# Altium schematic sheet Power_Tree.SchDoc
size A; SheetNumber: 3; SheetTotal: 5
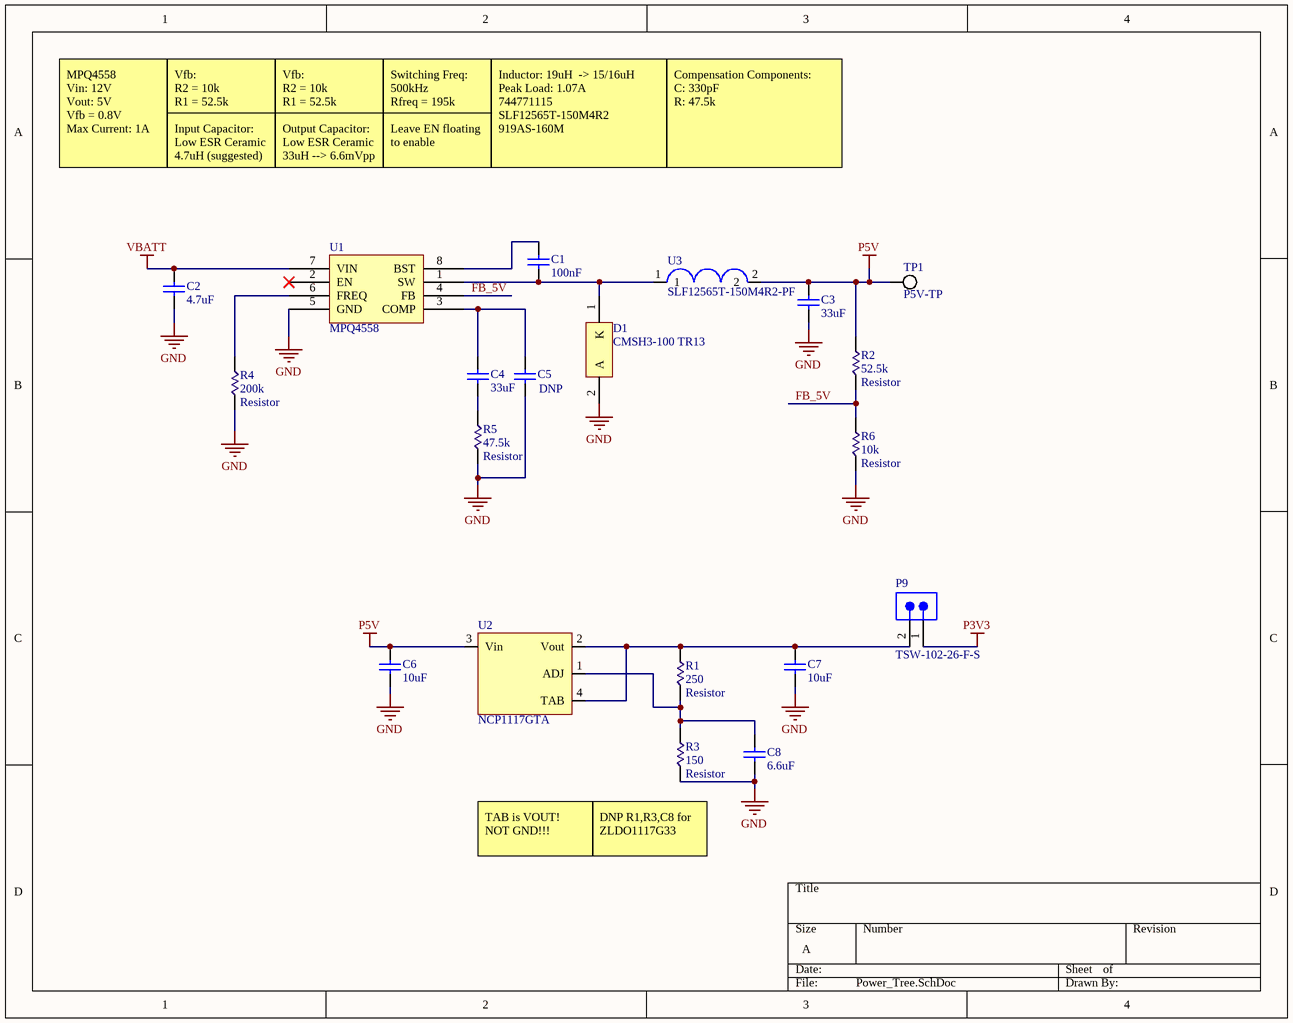
[diagram p0: Power_Tree.SchDoc]

## Parts
C1  value 100nF  [FOOTPRINT-1206-GEN]  (hidden comment: 100nF 1206)
C2  value 4.7uF  [FOOTPRINT-1206-GEN]  (hidden comment: CL31B475KBHVPNE)
C3  value 33uF  [FOOTPRINT-1206-GEN]
C4  value 33uF  [FOOTPRINT-1206-GEN]
C5  DNP  [FOOTPRINT-1206-GEN]
C6  value 10uF  [FOOTPRINT-1206-GEN]
C7  value 10uF  [FOOTPRINT-1206-GEN]
C8  value 6.6uF  [FOOTPRINT-1206-GEN]
D1  CMSH3-100 TR13  [ONSC-SMB-2-403A-03_V]
P9  TSW-102-26-F-S  [SMTC-TSW-102-26-XX-S]
R1  value 250  Type: Resistor  [FOOTPRINT-1206-GEN]  (hidden comment: Resistor 250 +/-1% 1206 1/4W)
R2  value 52.5k  Type: Resistor  [FOOTPRINT-1206-GEN]  (hidden comment: Resistor 52.5k +/-1% 1206 1/4W)
R3  value 150  Type: Resistor  [FOOTPRINT-1206-GEN]  (hidden comment: Resistor 150 +/-1% 1206 1/4W)
R4  value 200k  Type: Resistor  [FOOTPRINT-1206-GEN]  (hidden comment: Resistor 200k +/-1% 1206 1/4W)
R5  value 47.5k  Type: Resistor  [FOOTPRINT-1206-GEN]  (hidden comment: Resistor 47.5k +/-1% 1206 1/4W)
R6  value 10k  Type: Resistor  [FOOTPRINT-1206-GEN]  (hidden comment: Resistor 10k +/-1% 1206 1/4W)
TP1  P5V-TP  [FOOTPRINT-GENERIC-TP-VIA-1MM]  (no BOM)
U1  MPQ4558  [SOIC127P601X173-9N]
U2  NCP1117GTA  [SOT230P700X180-4N]
U3  SLF12565T-150M4R2-PF  [0.492" x 0.492"]

## Nets
GND: C2.1 C3.1 C5.1 C6.1 C7.1 C8.1 D1.2(A) R3.1 R4.1 R5.1 R6.1 U1.5(GND)
P3V3: P9.1
P5V: C3.2 C6.2 R2.2 TP1.1(TP) U2.3(Vin) U3.2
VBATT: C2.2 U1.7(VIN)
FB_5V: R2.1 R6.2 U1.4(FB)
NetC1_1: C1.1 D1.1(K) U1.1(SW) U3.1
NetC1_2: C1.2 U1.8(BST)
NetC4_1: C4.1 R5.2
NetC4_2: C4.2 C5.2 U1.3(COMP)
NetC7_2: C7.2 P9.2 R1.2 U2.2(Vout) U2.4(TAB)
NetC8_2: C8.2 R1.1 R3.2 U2.1(ADJ)
NetR4_2: R4.2 U1.6(FREQ)

Not connected (* = marked no-connect by the designer): U1 2(EN)*

## Notes on the sheet
- MPQ4558
  Vin: 12V
  Vout: 5V
  Vfb = 0.8V
  Max Current: 1A
- Vfb:
  R2 = 10k
  R1 = 52.5k
- Input Capacitor:
  Low ESR Ceramic
  4.7uH (suggested)
- Output Capacitor:
  Low ESR Ceramic
  33uH --> 6.6mVpp
- Switching Freq: 500kHz
  Rfreq = 195k
- Leave EN floating to enable
- Inductor: 19uH  -> 15/16uH
  Peak Load: 1.07A
  744771115
  SLF12565T-150M4R2
  919AS-160M
- Compensation Components:
  C: 330pF
  R: 47.5k
- TAB is VOUT!
  NOT GND!!!
- (near R3) DNP R1,R3,C8 for
  ZLDO1117G33

## Library data of the parts
C1 = CMP-001-00085-2: CAP CER 100nF 50V X7R 1206 ±10% 50V Ceramic Capacitor X7R 1206 (3216 Metric); Part Number: 1276-6781-1-ND; Published: 8-Jun-2000; LatestRevisionNote: Re-released for DXP Platform.; PackageReference: RAD-0.3; Publisher: Altium Limited; PackageDescription: Radial Cap, Thru-Hole; 2 Leads; 0.3 in Pin Spacing; Design Item ID: Capacitor-Generic-1206; Source: Generic.SchLib; Type: Capacitor
C2 = CMP-001-00085-2: CAP CER 4.7UF 50V X7R 1206 ±10% 50V Ceramic Capacitor X7R 1206 (3216 Metric); Part Number: 1276-6781-1-ND; Published: 8-Jun-2000; LatestRevisionNote: Re-released for DXP Platform.; PackageReference: RAD-0.3; Publisher: Altium Limited; PackageDescription: Radial Cap, Thru-Hole; 2 Leads; 0.3 in Pin Spacing; Design Item ID: Capacitor-Generic-1206; Source: Generic.SchLib; Type: Capacitor
C3 C4 = CMP-001-00085-2: CAP CER 33UF 50V X7R 1206 ±10% 50V Ceramic Capacitor X7R 1206 (3216 Metric); Part Number: 1276-6781-1-ND; Published: 8-Jun-2000; LatestRevisionNote: Re-released for DXP Platform.; PackageReference: RAD-0.3; Publisher: Altium Limited; PackageDescription: Radial Cap, Thru-Hole; 2 Leads; 0.3 in Pin Spacing; Design Item ID: Capacitor-Generic-1206; Source: Generic.SchLib; Type: Capacitor
C5 = CMP-001-00085-2: 1206; Part Number: 1276-6781-1-ND; Type: Capacitor; Published: 8-Jun-2000; LatestRevisionNote: Re-released for DXP Platform.; PackageReference: RAD-0.3; Publisher: Altium Limited; PackageDescription: Radial Cap, Thru-Hole; 2 Leads; 0.3 in Pin Spacing; Design Item ID: Capacitor-Generic-1206; Source: Generic.SchLib
C6 C7 = CMP-001-00085-2: CAP CER 10UF 50V X7R 1206 ±10% 50V Ceramic Capacitor X7R 1206 (3216 Metric); Part Number: 1276-6781-1-ND; Published: 8-Jun-2000; LatestRevisionNote: Re-released for DXP Platform.; PackageReference: RAD-0.3; Publisher: Altium Limited; PackageDescription: Radial Cap, Thru-Hole; 2 Leads; 0.3 in Pin Spacing; Design Item ID: Capacitor-Generic-1206; Source: Generic.SchLib; Type: Capacitor
C8 = CMP-001-00085-2: CAP CER 6.6UF 50V X7R 1206 ±10% 50V Ceramic Capacitor X7R 1206 (3216 Metric); Part Number: 1276-6781-1-ND; Published: 8-Jun-2000; LatestRevisionNote: Re-released for DXP Platform.; PackageReference: RAD-0.3; Publisher: Altium Limited; PackageDescription: Radial Cap, Thru-Hole; 2 Leads; 0.3 in Pin Spacing; Design Item ID: Capacitor-Generic-1206; Source: Generic.SchLib; Type: Capacitor
D1 = CMP-1055-00373-1: CMSH3-100 TR13 Schottky Power Rectifier, 2-Pin SMB, Pb-Free, Tape and Reel; PartNumber: SS22T3G; Manufacturer: On Semiconductor; IFSM Max (A): 75; Configuration: Single; DatasheetVersion: Rev. 4; PackageVersion: Rev. J, 07/2012; ComponentLink3Description: Package Specification; ComponentLink2Description: Datasheet; PackageDescription: 2-Pin Small Molded Package, J-Bend Lead, Body 4.33 x 3.625 mm; Mounting Technology: Surface Mount; ComponentLink3URL: http://www.onsemi.com/pub_link/Collateral/403A-03.PDF; Packing: Tape and Reel; ComponentLink1URL: http://www.onsemi.com/; ComponentLink2URL: http://www.onsemi.cn/pub_link/Collateral/SS24-D.PDF; PackageReference: SMB-2-403A-03; RoHS: TRUE; ComponentLink1Description: Manufacturer URL
P9 = CMP-002-00072-1: Headers & Wire Housings Classic PCB Header Strips, 0.100 pitch; Number of Positions: 2; Max Voltage Rating (AC): 550V; Gender: Male; Pitch: 2.54mm; Contact Post Length: 3.2mm; Voltage Rating: 500V; Max Current Rating: 7.6A; Contact Material: Bronze; Contact Gender: Male; Contact Type: -; REACH SVHC: No SVHC; Min Operating Temperature: -55°C; Housing Material: Polyester; Packaging: Bulk; Termination: Through Hole; Max Operating Temperature: 125°C; Orientation: Vertical; Flammability Rating: UL94 V-0; Package Quantity: 1; Depth: 2.54mm; Contact Plating: Gold; Number of Rows: 1; Radiation Hardening: No; Number of Contacts: 2; Length: 5.08mm; RoHS Compliant: Yes; Housing Color: Black; Weight: 0.001257oz; Contact Mating Length: 5.84mm; Series: TSW
R1 = CMP-009-00204-1: 250 ±1% 0.25W, 1/4W Chip Resistor 1206 (3216 Metric) Automotive AEC-Q200 Thick Film; Design Item ID: Resistor-Generic-1206-3216; Source: Generic.SchLib
R2 = CMP-009-00204-1: 52.5k ±1% 0.25W, 1/4W Chip Resistor 1206 (3216 Metric) Automotive AEC-Q200 Thick Film; Design Item ID: Resistor-Generic-1206-3216; Source: Generic.SchLib
R3 = CMP-009-00204-1: 150 ±1% 0.25W, 1/4W Chip Resistor 1206 (3216 Metric) Automotive AEC-Q200 Thick Film; Design Item ID: Resistor-Generic-1206-3216; Source: Generic.SchLib
R4 = CMP-009-00204-1: 200k ±1% 0.25W, 1/4W Chip Resistor 1206 (3216 Metric) Automotive AEC-Q200 Thick Film; Design Item ID: Resistor-Generic-1206-3216; Source: Generic.SchLib
R5 = CMP-009-00204-1: 47.5k ±1% 0.25W, 1/4W Chip Resistor 1206 (3216 Metric) Automotive AEC-Q200 Thick Film; Design Item ID: Resistor-Generic-1206-3216; Source: Generic.SchLib
R6 = CMP-009-00204-1: 10k ±1% 0.25W, 1/4W Chip Resistor 1206 (3216 Metric) Automotive AEC-Q200 Thick Film; Design Item ID: Resistor-Generic-1206-3216; Source: Generic.SchLib
TP1 = CMP-025-000000-1: Source: Generic.SchLib; Design Item ID: Misc-Generic-TP
U1 = CMP-047-000002-2: Source: Schlib1.SchLib; Design Item ID: MPQ4558